# EAGLE design Borealis (EAGLE 7.3.0)
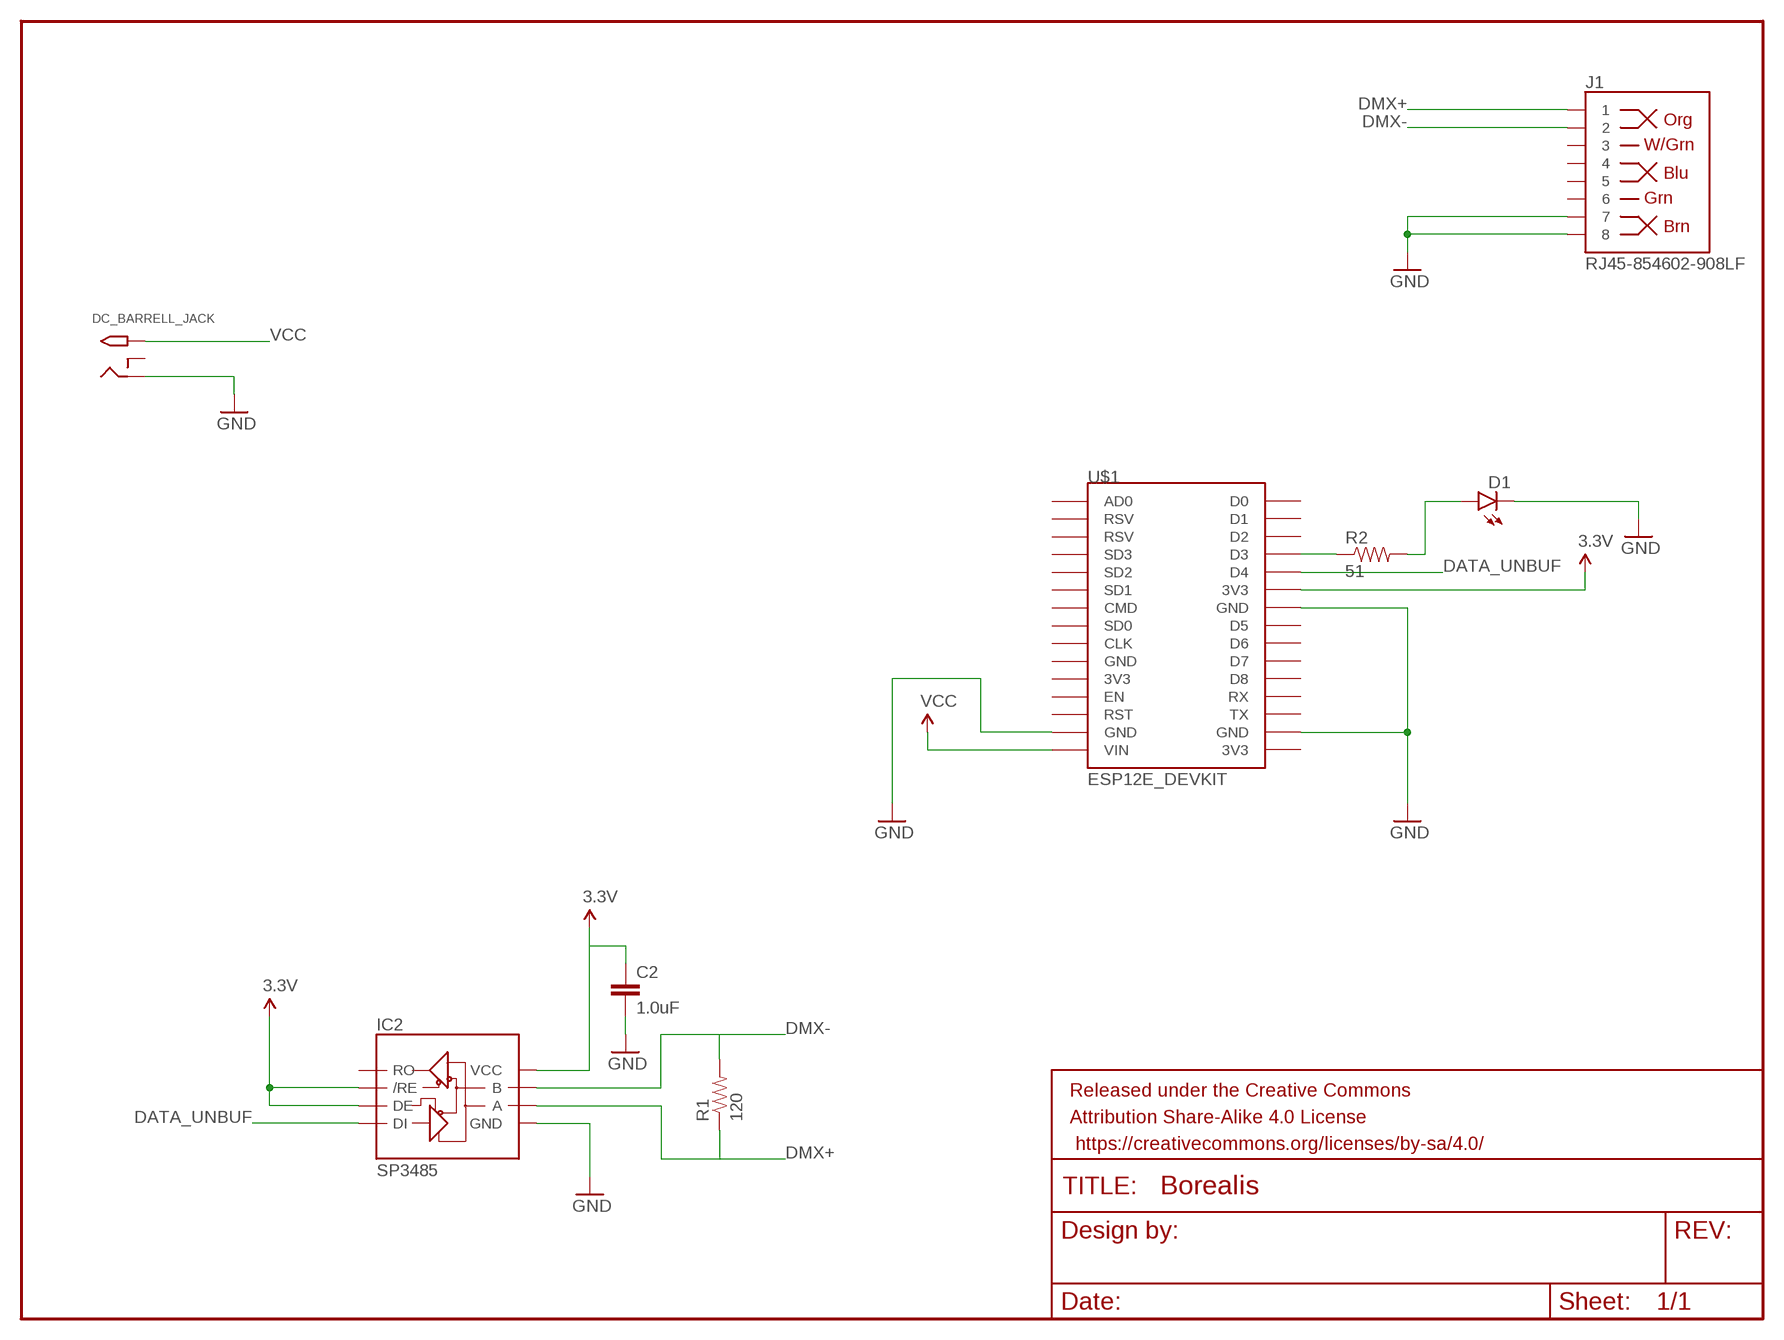
[diagram p0: schematic, sheet 1]

## Parts
C2  1.0uF  1.0UF-16V-10%(0603)  [0603-CAP]
D1  LED1206-BOTTOM  [LED-1206-BOTTOM]
DC_BARRELL_JACK  2.1MMJACKTHM  [PJ-102A]
FRAME1  FRAME-LETTERNO_PACKAGE  [DUMMY]
IC2  SP3485  RS485SOIC  [SO08]
J1  RJ45-854602-908LF  [RJ45-GREG]
R1  120  RESISTOR0603  [0603-RES]
R2  51  RESISTOR0603-RES  [0603-RES]
U$1  ESP12E_DEVKIT  [DEV_LAYOUT]

## Nets
3.3V: C2.1 IC2.2(/RE) IC2.3(DE) IC2.8(VCC) U$1.3V3@1(3V3)
DATA_UNBUF: IC2.4(DI) U$1.D4
DMX+: IC2.6(A) J1.1 R1.1
DMX-: IC2.7(B) J1.2 R1.2
GND: C2.2 D1.C DC_BARRELL_JACK.RING IC2.5(GND) J1.7 J1.8 U$1.GND@1(GND) U$1.GND@2(GND) U$1.GND@3(GND)
LED_PWR: D1.A R2.2
N$1: R2.1 U$1.D3
VCC: DC_BARRELL_JACK.TIP U$1.VIN
Unconnected: DC_BARRELL_JACK.RING_SW IC2.1(RO) J1.3 J1.4 J1.5 J1.6 U$1.3V3@0(3V3) U$1.3V3@2(3V3) U$1.AD0 U$1.CLK U$1.CMD U$1.D0 U$1.D1 U$1.D2 U$1.D5 U$1.D6 U$1.D7 U$1.D8 U$1.EN U$1.GND@0(GND) U$1.RST U$1.RSV@0(RSV) U$1.RSV@1(RSV) U$1.RX U$1.SD0 U$1.SD1 U$1.SD2 U$1.SD3 U$1.TX

## Library data of the parts
C2 = SparkFun-Capacitors:1.0UF-16V-10%(0603): CAP-00868; PROD_ID: CAP-00868
D1 = SparkFun-LED:LED: LEDs Standard schematic elements and footprints for 5mm, 3mm, 1206, and 0603 sized LEDs. 5mm - Spark Fun Electronics SKU : COM-00529 (and others)
DC_BARRELL_JACK = adafruit:2.1MMJACK: 2.1mm x 5.5mm THM DC jack with internal switch. Digikey part #PJ-102A, 4UCON part #05537 2.1mm x 5.5mm SMT DC jack with internal switch. Digikey part #PJ-002A-SMT, 4UCON part #03267 By microbuilder.eu & adafruit.com
FRAME1 = SparkFun-Aesthetics:FRAME-LETTER: Schematic Frame Standard 8.5x11 US Letter frame; DESIGNER: Nobody; VERSION: v01
IC2 = SparkFun-DigitalIC:RS485: RS485 transceiver
J1 = SparkFun-Connectors:RJ45-8: RJ45 Jack Simple RJ45, 8-pin connection - connector for common Cat5, Cat5e, and Cat6 Ethernet cables. Footprint not yet proven in production. Connector sku is PRT-00643; Breakout PCB sku is BOB-00716.
R1 = SparkFun-Resistors:RESISTOR: Resistor Basic schematic elements and footprints for 0603, 1206, and PTH resistors.
R2 = SparkFun-Passives:RESISTOR: Resistor Basic schematic elements and footprints for 0603, 1206, and PTH resistors.
U$1 = ESP12E_DEVKIT:ESP12E_DEVKIT: ESP12E DEVKIT BOARD

## Board
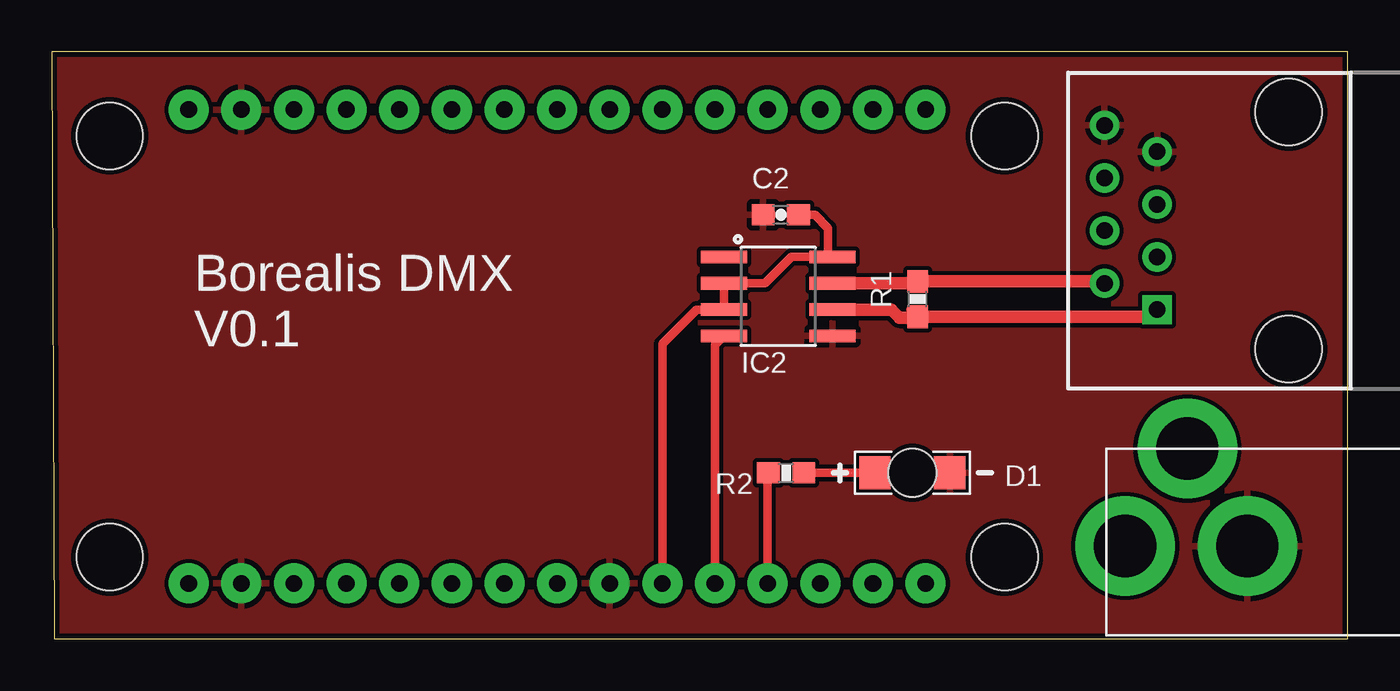
[diagram p1: board, top side]
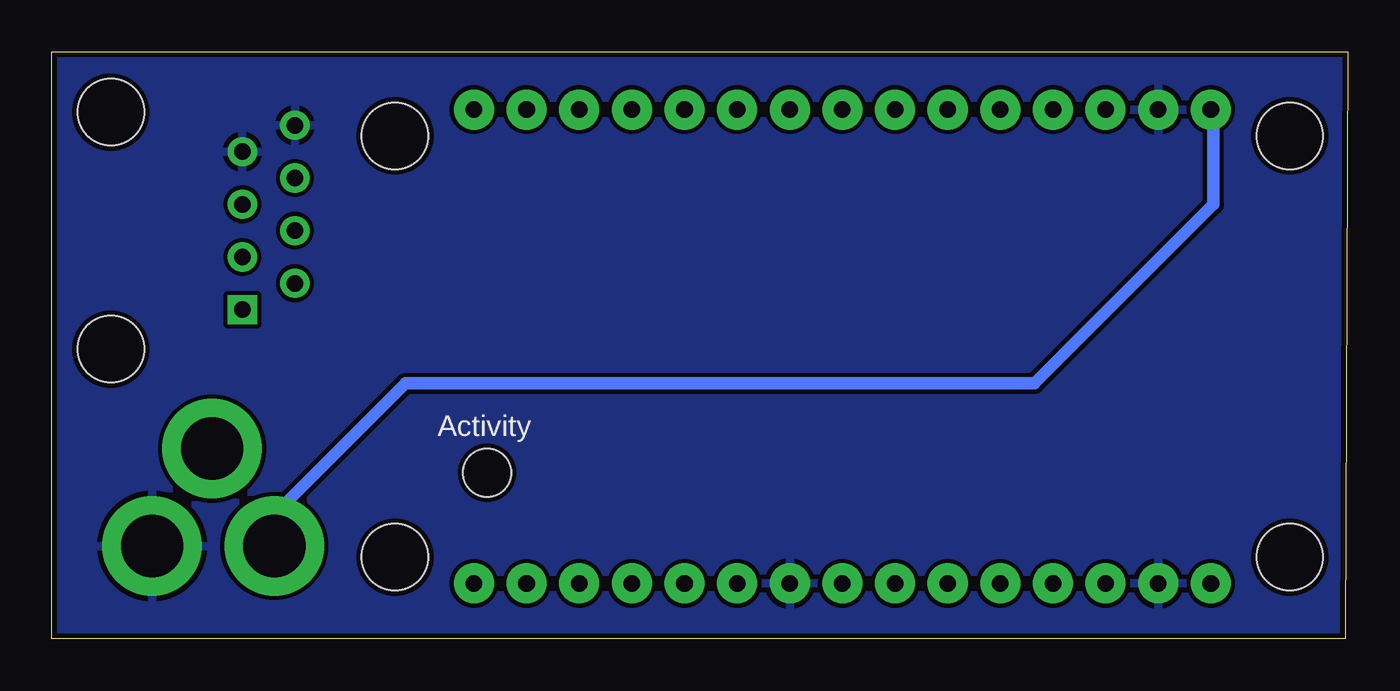
[diagram p2: board, bottom side, seen from below]

Size 62.53 x 28.31 mm. Coordinates in mm from the lower left corner, seen from the top.
Outline: 0.13,0 62.53,0 62.53,28.31 0,28.31 0.13,0
Copper layers (1*16): Top 0.035mm / dielectric 1.5mm / Bottom 0.035mm
Design rules "SparkFun": minimum track width 8mil, minimum drill 20mil, track to track 8mil, track to pad 8mil, pad to pad 8mil, via to via 8mil, smd to smd 8mil, copper to edge 10mil, drill to drill 8mil, minimum pad ring 12mil, minimum via ring 10mil, stop-mask expansion 4mil, vias tented up to drill 25mil, thermal gap 10mil

### Footprints (pad centres in the part's own frame; a part is rotated, then mirrored left to right if it is on the bottom)
0603-CAP = smd 1.1 x 1: 1 -0.85,0; 2 0.85,0
LED-1206-BOTTOM = smd 1.5 x 1.6: A -1.8,0; C 1.8,0 | hole 2.3: 0,0
PJ-102A = drill 3 pad 4.8: RING 0.1,-3.39; RING_SW -4.6,-6.29; TIP 0.1,-9.29
SO08 = smd 0.61 x 2.21: 1 -1.905,-2.616; 2 -0.635,-2.616; 3 0.635,-2.616; 4 1.905,-2.616; 5 1.905,2.616; 6 0.635,2.616; 7 -0.635,2.616; 8 -1.905,2.616
RJ45-GREG = drill 0.8 square: 1 -3.81,6.35 | drill 0.8: 2 -2.54,8.89; 3 -1.27,6.35; 4 0,8.89; 5 1.27,6.35; 6 2.54,8.89; 7 3.81,6.35; 8 5.08,8.89 | hole 3.2: -5.715,0; 5.715,0
0603-RES = smd 1.1 x 1: 1 -0.85,0; 2 0.85,0
DEV_LAYOUT = drill 0.8 pad 1.93: 3V3@0 -11.43,-6.35; 3V3@1 11.43,6.35; 3V3@2 11.43,-16.51; AD0 -11.43,19.05; CLK -11.43,-1.27; CMD -11.43,3.81; D0 11.43,19.05; D1 11.43,16.51; D2 11.43,13.97; D3 11.43,11.43; D4 11.43,8.89; D5 11.43,1.27; D6 11.43,-1.27; D7 11.43,-3.81; D8 11.43,-6.35; EN -11.43,-8.89; GND@0 -11.43,-3.81; GND@1 -11.43,-13.97; GND@2 11.43,3.81; GND@3 11.43,-13.97; RST -11.43,-11.43; RSV@0 -11.43,16.51; RSV@1 -11.43,13.97; RX 11.43,-8.89; SD0 -11.43,1.27; SD1 -11.43,6.35; SD2 -11.43,8.89; SD3 -11.43,11.43; TX 11.43,-11.43; VIN -11.43,-16.51 | hole 3.2: -10.16,22.86; 10.16,22.86; 10.16,-20.32; -10.16,-20.32

### Placement (x,y rotation side)
C2  35.18,20.45 180 top
D1  41.53,8 0 top
DC_BARRELL_JACK  61.09,4.57 270 top
FRAME1  -7.49,-6.86 0 top  (outside the outline)
IC2  35.05,16.51 270 top
J1  59.69,19.68 90 top
R1  41.78,16.38 90 top
R2  35.43,8 0 top
U$1  23.11,14.1 270 top

### Tracks (layer width: path | path; a pad name or v marks a point on that pad's centre or on a via)
3.3V
  Top 0.406: U$1.3V3@1 29.46,14.22 31.11,15.88 IC2.3 IC2.2 34.42,17.14 35.69,18.41 IC2.8 37.47,18.62 37.47,19.81 36.83,20.45 C2.1
DATA_UNBUF
  Top 0.406: U$1.D4 32,14.17 IC2.4
DMX+
  Top 0.406: 41.44,15.88 R1.1
  Top 0.61: IC2.6 40.51,15.88 40.89,15.49 41.74,15.49 R1.1 52.74,15.53 J1.1
DMX-
  Top 0.61: IC2.7 41.7,17.14 R1.2 50.46,17.23 J1.2
GND
  pour Bottom: 71.12,27.94 -2.54,27.94 -2.54,-2.54 71.12,-2.54
  pour Top: -1.27,27.94 71.12,27.94 71.12,-3.81 -1.27,-3.81
LED_PWR
  Top 0.406: R2.2 D1.A
N$1
  Top 0.406: U$1.D3 34.54,7.96 R2.1
VCC
  Bottom 0.61: DC_BARRELL_JACK.TIP 51.8,5.99 45.47,12.32 15.11,12.32 6.48,20.96 6.48,25.4 U$1.VIN

### Text on the board
tPlace: Borealis DMX / V0.1
bNames: Activity